# EAGLE design Audio_board_1_1 (EAGLE 6.6.0)
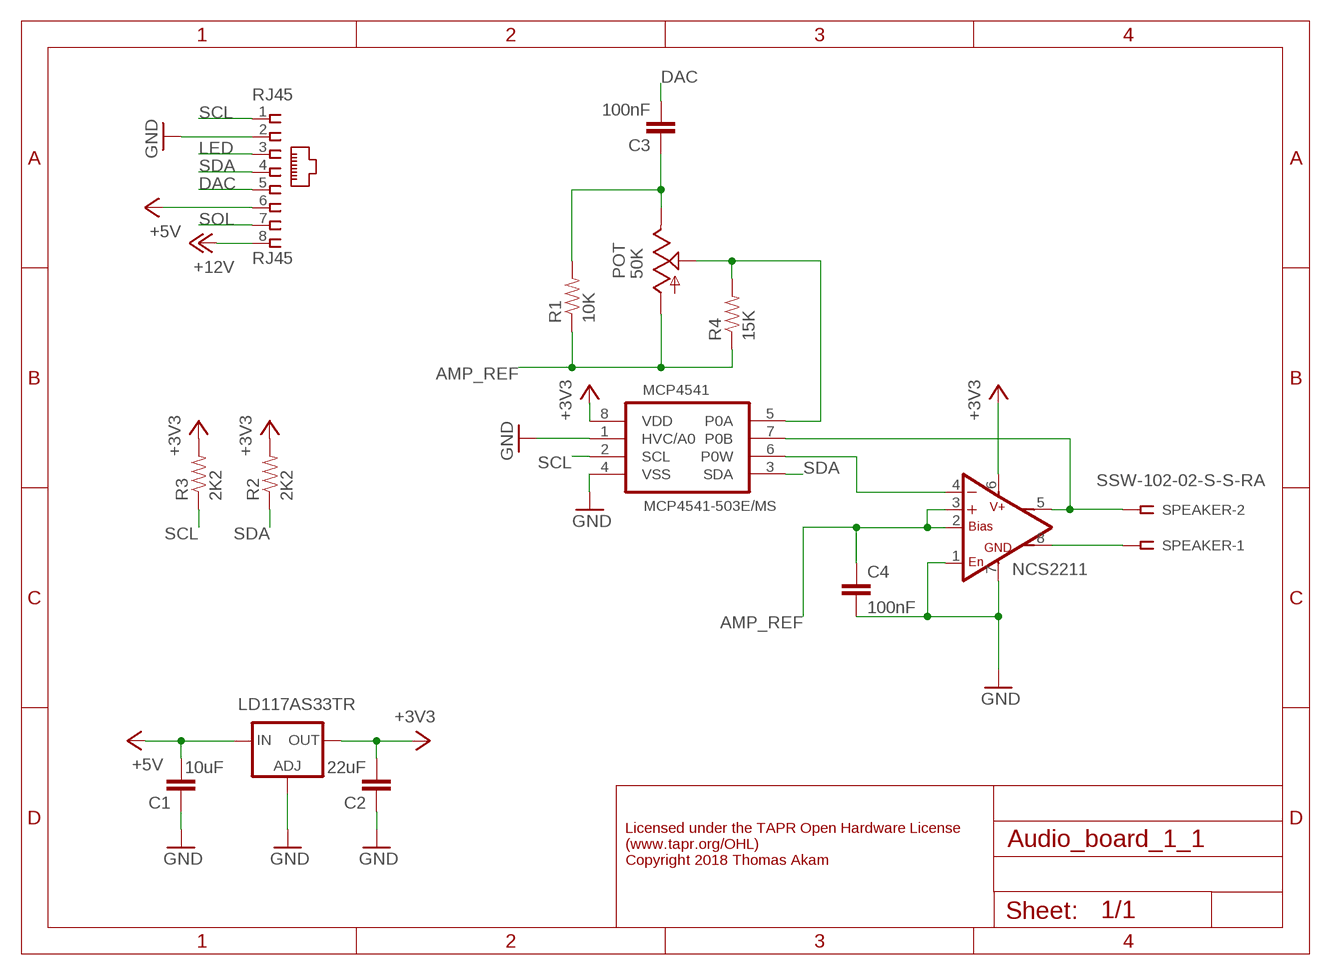
[diagram p0: schematic, sheet 1]

## Parts
C1  10uF  C-EUC1206  [C1206]
C2  22uF  C-EUC1206  [C1206]
C3  100nF  C-EUC0805  [C0805]
C4  100nF  C-EUC0805  [C0805]
LD117  LD117AS33TR  [SOT223]
MCP4541  MCP4541-503E/MS  [SOP65P490X110-8N]
NCS2211  NCS22111M  [SO08]
POT  50K  TRIM_US-RS3  [RS3]
R1  10K  0.3OHM-1/8W-1%(0805)  [0805]
R2  2K2  0.3OHM-1/8W-1%(0805)  [0805]
R3  2K2  0.3OHM-1/8W-1%(0805)  [0805]
R4  15K  0.3OHM-1/8W-1%(0805)  [0805]
RJ45  RJ45  RJ45VERTICAL  [RJ45-NO-SHIELD-VERTICAL]
SPEAKER  SSW-102-02-S-S-RA  [SSW-102-02-S-S-RA]

## Nets
+3V3: C2.2 LD117.4(OUT) MCP4541.8(VDD) NCS2211.6(VS) R2.2 R3.2
+5V: C1.2 LD117.3(IN) RJ45.6
+12V: RJ45.8
AMP_REF: C4.1 NCS2211.2(BIAS) NCS2211.3(+IN) POT.A R1.1 R4.1
DAC: C3.2 RJ45.5
GND: C1.1 C2.1 C4.2 LD117.1(ADJ) MCP4541.1(HVC/A0) MCP4541.4(VSS) NCS2211.1(ENABLE) NCS2211.7(GND) RJ45.2
LED: RJ45.3
N$2: NCS2211.8(-OUT) SPEAKER.1
SCL: MCP4541.2(SCL) R3.1 RJ45.1
SDA: MCP4541.3(SDA) R2.1 RJ45.4
SIG1: C3.1 POT.E R1.2
SIG2: MCP4541.5(P0A) POT.S R4.2
SIG3: MCP4541.6(P0W) NCS2211.4(-IN)
SOL: RJ45.7
SPEAKER+: MCP4541.7(P0B) NCS2211.5(+OUT) SPEAKER.2

## Notes on the sheet
- Licensed under the TAPR Open Hardware License
  (www.tapr.org/OHL)
  Copyright 2018 Thomas Akam

## Library data of the parts
C1-C4 = rcl:C-EU: CAPACITOR, European symbol
LD117 = v-reg:LD117A?*: Low drop fixed and adjustable positive voltage regulators 1 A Source: http://www.st.com/stonline/products/literature/ds/7194/ld1117axx.pdf
MCP4541 = Digital_potentiometers:MCP4541-503E/MS: Digital POT; MPN: MCP4541-503E/MS; OC_FARNELL: 1840713; OC_NEWARK: 77M2867; PACKAGE: MSOP-8; SUPPLIER: Microchip
NCS2211 = NCS2211:NCS2211: Low Voltage Audio Power Amplifier Source: http://cache.national.com/ds/LM/LM386.pdf
POT = pot:TRIM_US-: POTENTIOMETER
R1-R4 = SparkFun-Resistors:0.3OHM-1/8W-1%(0805): RES-11622; PROD_ID: RES-11622; VALUE: 0.3
RJ45 = con-tycoelectronics-vertical_RJ45:RJ45: CORCOM Modular RJ Jacks No Shield Source: www.tycoelectronics.com .. ENG_DS_1654001_1099_RJ_L_0507.pdf
SPEAKER = con-samtec:SSW-102-02-S-S: THROUGH-HOLE .025" SQ POST SOCKET Source: Samtec SSW.pdf; MPN: SSW-102-02-S-S-RA; OC_FARNELL: unknown; OC_NEWARK: 11P9352

## Net classes
1 power: width 0.508 mm

## Board
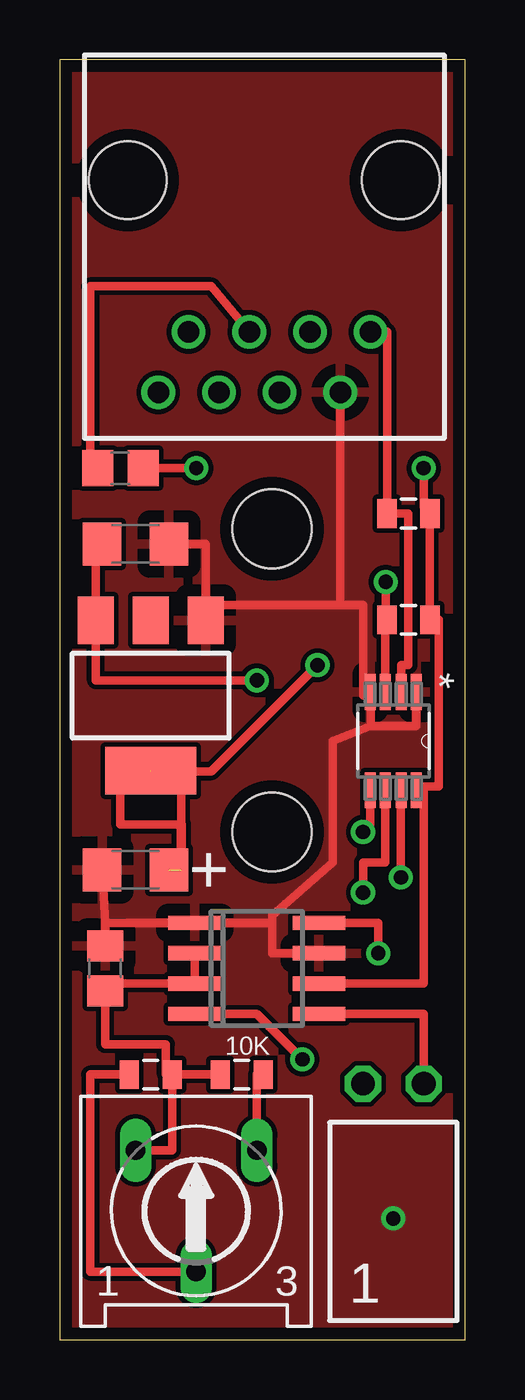
[diagram p1: board, top side]
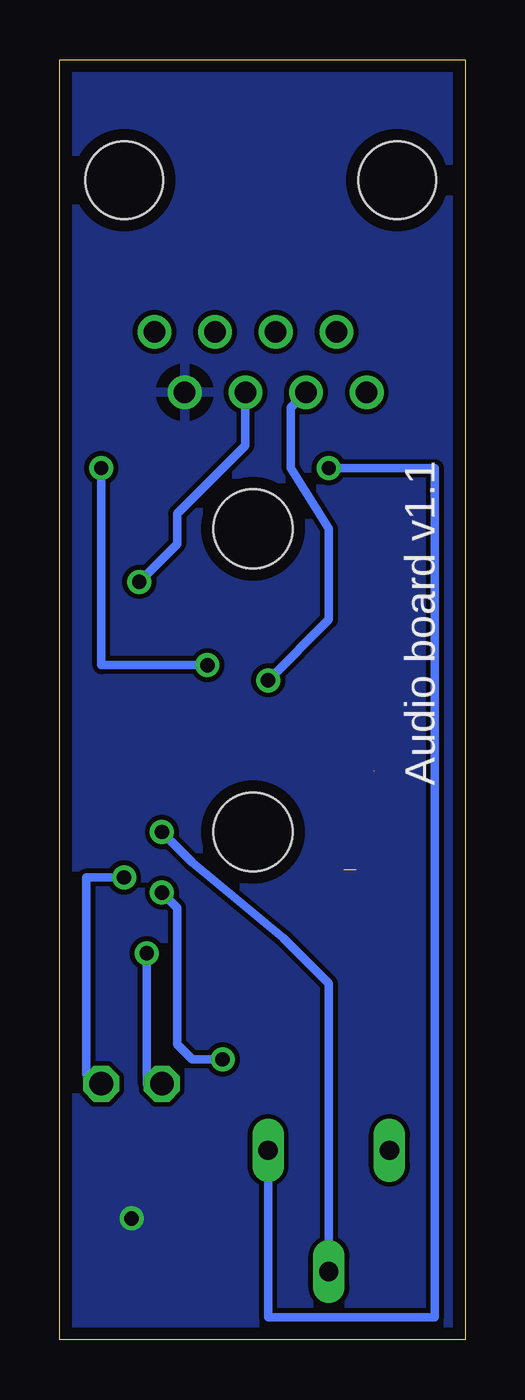
[diagram p2: board, bottom side, seen from below]

Size 16.98 x 53.62 mm. Coordinates in mm from the lower left corner, seen from the top.
Outline: 0,0 16.98,0 16.98,53.62 0,53.62 0,0
Copper layers (1*16): Top 0.035mm / dielectric 1.5mm / Bottom 0.035mm
Design rules "default *": minimum track width 14mil, minimum drill 20mil, track to track 8mil, track to pad 8mil, pad to pad 8mil, via to via 8mil, smd to smd 8mil, copper to edge 20mil, drill to drill 8mil, minimum pad ring 10mil, minimum via ring 8mil, stop-mask expansion 4mil, vias tented up to drill 0mil, thermal gap 20mil
Holes 3.3 mm at 8.89,33.97 8.89,21.27

### Footprints (pad centres in the part's own frame; a part is rotated, then mirrored left to right if it is on the bottom)
C1206 = smd 1.6 x 1.8: 1 -1.4,0; 2 1.4,0
C0805 = smd 1.3 x 1.5: 1 -0.95,0; 2 0.95,0
SOT223 = smd 1.5 x 2: 1 -2.3,-3.15; 2 0,-3.15; 3 2.3,-3.15 | smd 3.8 x 2: 4 0,3.15
SOP65P490X110-8N = smd 1.499 x 0.457: 1 -2.057,0.965; 2 -2.057,0.33; 3 -2.057,-0.33; 4 -2.057,-0.965; 5 2.057,-0.965; 6 2.057,-0.33; 7 2.057,0.33; 8 2.057,0.965
SO08 = smd 0.6 x 2.2: 1 -1.905,-2.6; 2 -0.635,-2.6; 3 0.635,-2.6; 4 1.905,-2.6; 5 1.905,2.6; 6 0.635,2.6; 7 -0.635,2.6; 8 -1.905,2.6
RS3 = drill 0.813 long: A -2.54,2.54; E 2.54,2.54; S 0,-2.54
0805 = smd 0.8 x 1.2: 1 -0.9,0; 2 0.9,0
RJ45-NO-SHIELD-VERTICAL = drill 0.9 pad 1.4: 1 -4.445,5.08; 2 -3.175,7.62; 3 -1.905,5.08; 4 -0.635,7.62; 5 0.635,5.08; 6 1.905,7.62; 7 3.175,5.08; 8 4.445,7.62 | hole 3.251: -5.715,-1.27; 5.715,-1.27
SSW-102-02-S-S-RA = drill 1 pad 1.5 octagon: 1 -1.27,1.524; 2 1.27,1.524

### Placement (x,y rotation side)
C1  3.17,33.34 180 top
C2  3.17,19.68 0 top
C3  2.54,36.51 180 top
C4  1.91,15.56 90 top
LD117  3.81,26.99 180 top
MCP4541  13.97,25.08 270 top
NCS2211  8.26,15.56 270 top
POT  5.71,5.4 0 top
R1  7.62,11.11 0 top
R2  14.61,30.16 0 top
R3  14.61,34.61 0 top
R4  3.81,11.11 180 top
RJ45  8.57,47.31 180 top
SPEAKER  13.97,9.21 0 top

### Tracks (layer width: path | path; a pad name or v marks a point on that pad's centre or on a via)
+3V3  (via drill 0.6)  (2 unrouted)
  Top 0.356: NCS2211.6 15.24,14.92 15.24,23.02 MCP4541.8 14.94,23.18 15.88,23.18 15.88,30.16 R2.2 R3.2 15.24,34.87 v15.24,36.51 | 3.81,23.81 2.54,23.81 2.54,21.59 5.08,21.59 5.08,23.81 6.35,23.81 v10.79,28.26
  Top 0.406: 5.08,19.68 5.08,21.59
  Bottom 0.356: v10.79,28.26 15.24,28.26 v15.24,36.51
+5V  (via drill 0.6)
  Top 0.356: v8.26,27.62 1.51,27.62 LD117.3 1.51,33.34 C1.2
  Bottom 0.356: v8.26,27.62 5.71,30.16 5.71,33.97 7.3,36.51 7.3,39.05 RJ45.6
AMP_REF
  Top 0.356: R1.1 R4.1 | R4.1 4.45,11.11 4.45,12.38 1.91,12.38 C4.1 1.91,14.92 NCS2211.3 NCS2211.2 | POT.A 4.71,7.94 R4.1
DAC
  Top 0.356: RJ45.5 6.35,44.13 1.27,44.13 1.27,36.51 C3.2
GND  (via drill 0.6)
  Top 0.356: C4.2 1.91,17.46 | 1.91,17.46 C2.1 | 1.91,17.46 NCS2211.1 8.89,17.46 | 13.02,25.72 13.02,27.14 MCP4541.4 13.01,26.99 12.7,26.99 12.7,30.77 11.75,30.77 | 13.02,25.72 14.94,25.72 MCP4541.1 | C1.1 6.11,33.34 6.11,30.77 | 6.11,30.77 LD117.1 | 13.02,25.72 11.43,25.08 11.43,20 8.89,17.78 8.89,17.46 | 8.89,17.46 8.89,16.19 NCS2211.7 | RJ45.2 11.75,30.77 | 11.75,30.77 6.11,30.77
  other vias: 13.97,5.08
  pour Bottom: 17.14,0 17.14,53.98 0,53.98 0,0.32
  pour Top: 0,0 0,53.98 17.14,53.98 17.14,0.32
N$2  (via drill 0.6)
  Top 0.356: v13.34,16.19 13.34,17.46 11.43,17.46 NCS2211.8
  Bottom 0.356: SPEAKER.1 13.34,10.73 v13.34,16.19
SCL
  Top 0.356: MCP4541.2 14.3,28.26 14.61,28.26 14.61,34.61 R3.1 13.71,42.23 RJ45.1
SDA  (via drill 0.6)
  Top 0.356: MCP4541.3 13.64,30.16 R2.1 13.65,30.21 v13.65,31.75
  Bottom 0.356: RJ45.4 9.21,37.47 12.06,34.61 12.06,33.34 v13.65,31.75
SIG1  (via drill 0.6)
  Top 0.356: C3.1 v5.71,36.51 | R1.2 8.26,11.11 POT.E
  Bottom 0.356: v5.71,36.51 1.27,36.51 1.27,27.62 1.27,0.95 8.26,0.95 POT.E
SIG2  (via drill 0.6)
  Top 0.356: R4.2 1.27,11.11 1.27,2.86 POT.S | MCP4541.5 13.01,21.58 v12.7,21.27
  Bottom 0.356: v12.7,21.27 11.43,20 7.62,16.83 5.71,14.92 POT.S
SIG3  (via drill 0.6)
  Top 0.356: NCS2211.4 8.26,13.65 v10.16,11.75 | v12.7,18.73 12.7,19.37 12.7,20 13.64,20 MCP4541.6
  Bottom 0.356: v10.16,11.75 11.43,11.75 12.06,12.38 12.06,18.1 v12.7,18.73
SPEAKER+  (via drill 0.6)
  Top 0.356: SPEAKER.2 15.24,13.65 NCS2211.5 | MCP4541.7 14.29,23.02 v14.29,19.37
  Bottom 0.356: v14.29,19.37 15.88,19.37 15.88,11.11 15.24,11.11 SPEAKER.2

### Text on the board
tPlace: +
bNames: Audio board v1.1
Document: Licensed under the TAPR Open Hardware License / (www.tapr.org/OHL) / Copyright 2018 Thomas Akam